# Altium schematic sheet Bluetooth.SchDoc
size A4
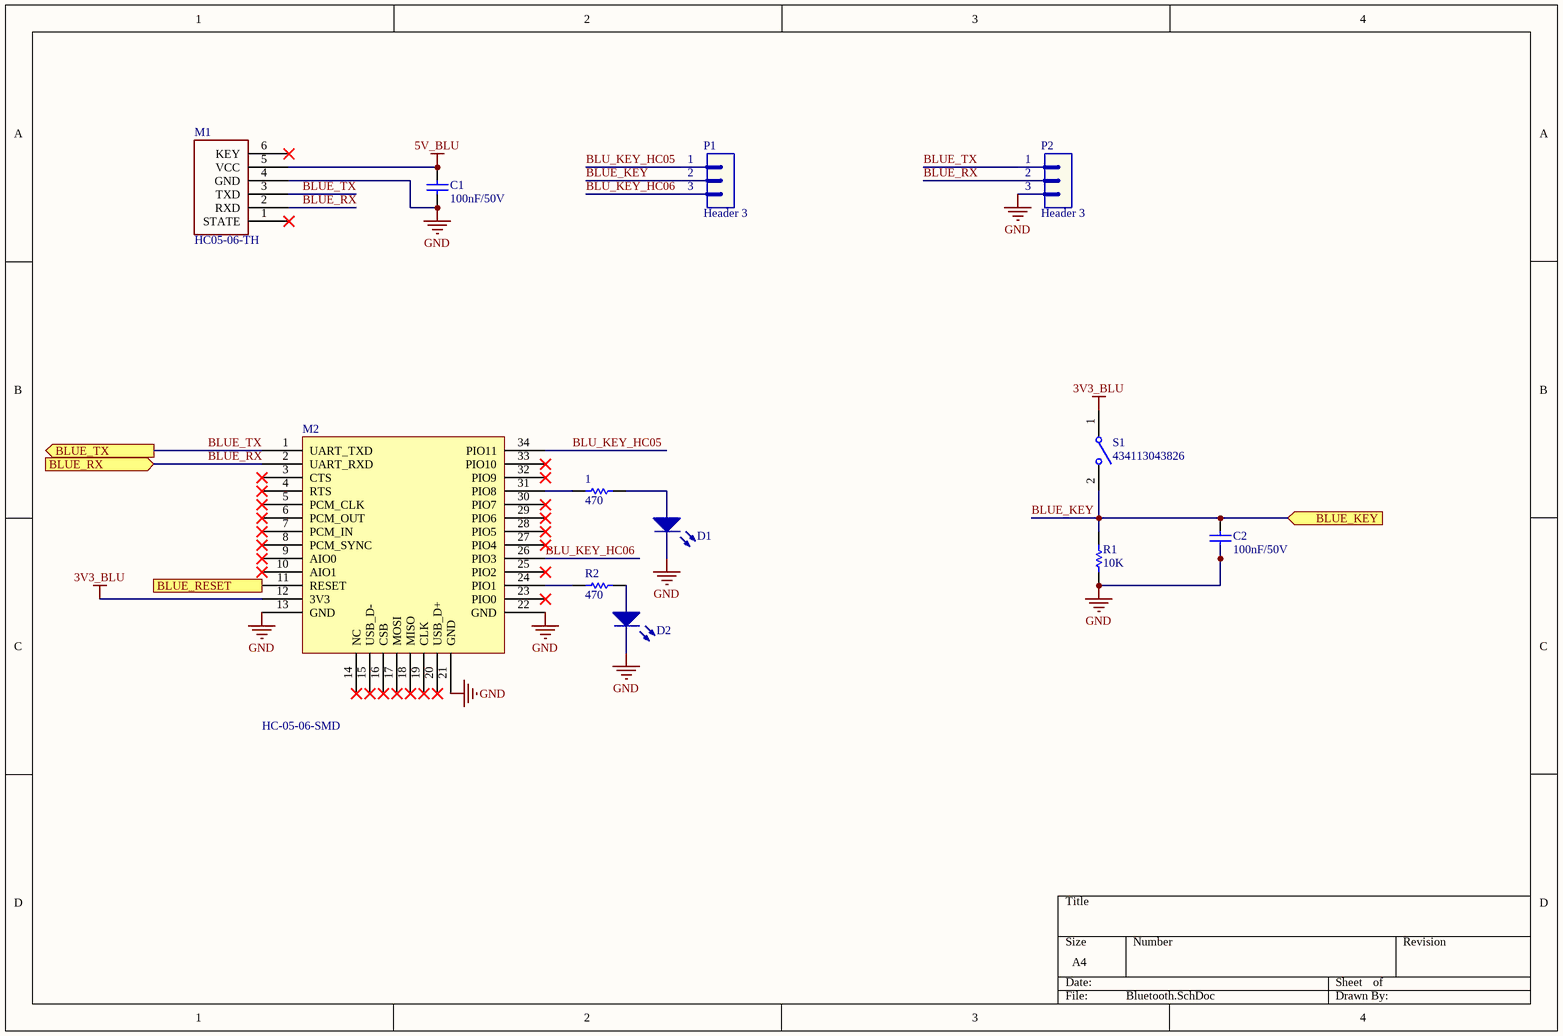
[diagram p0: Bluetooth.SchDoc]

## Parts
1  value 470  [RES-SM-0805]  (hidden comment: Res-1K-0805)
C1  value 100nF/50V  [CAP-SM-0805]  (hidden comment: Cap-1nF-50V-0805)
C2  value 100nF/50V  [CAP-SM-0805]  (hidden comment: Cap-1nF-50V-0805)
D1  LED  [LED_0603_Blue]  (value not drawn)
D2  LED  [LED_0603_Blue]  (value not drawn)
M1  HC05-06-TH  [HC-05-06-TH]
M2  HC-05-06-SMD  [HC-05-06-SMD]
P1  Header 3  [JP3]
P2  Header 3  [JP3]
R1  value 10K  [RES-SM-0805]  (hidden comment: Res-0-0805)
R2  value 470  [RES-SM-0805]  (hidden comment: Res-1K-0805)
S1  434113043826  [434113043826]

## Ports
BLUE_KEY (in), BLUE_RESET (in), BLUE_RX (in), BLUE_TX (out)

## Nets
3V3_BLU: M2.12(3V3) S1.1
5V_BLU: C1.2 M1.5(VCC)
GND: C1.1 C2.1 D1.2(K) D2.2(K) M1.4(GND) M2.13(GND) M2.21(GND) M2.22(GND) P2.3 R1.2
BLU_KEY_HC05: M2.34(PIO11) P1.1
BLU_KEY_HC06: M2.26(PIO3) P1.3
BLUE_KEY: C2.2 P1.2 R1.1 S1.2 ; port BLUE_KEY
BLUE_RESET: M2.11(RESET) ; port BLUE_RESET
BLUE_RX: M1.2(RXD) M2.2(UART_RXD) P2.2 ; port BLUE_RX
BLUE_TX: M1.3(TXD) M2.1(UART_TXD) P2.1 ; port BLUE_TX
Net1_1: 1.1 M2.31(PIO8)
Net1_2: 1.2 D1.1(A)
NetD2_1: D2.1(A) R2.2
NetM2_24: M2.24(PIO1) R2.1

Not connected (* = marked no-connect by the designer): M1 1(STATE)* 6(KEY)*; M2 3(CTS)* 4(RTS)* 5(PCM_CLK)* 6(PCM_OUT)* 7(PCM_IN)* 8(PCM_SYNC)* 9(AIO0)* 10(AIO1)* 14(NC)* 15(USB_D-)* 16(CSB)* 17(MOSI)* 18(MISO)* 19(CLK)* 20(USB_D+)* 23(PIO0)* 25(PIO2)* 27(PIO4)* 28(PIO5)* 29(PIO6)* 30(PIO7)* 32(PIO9)* 33(PIO10)*

## Library data of the parts
1 R2 = Res-1K-0805: RES 1K OHM 1% 1/4W 0805; Manufacturer: Stackpole Electronics Inc; Manufacturer Part Number: RNCP0805FTD1K00; Local Supplier: thegioiic; Local Supplier Link: https://thegioiic.com/products/dien-tro-1k-ohm-0805-5; Supplier 1: Digikey; Supplier 1 Link: https://www.digikey.com/product-detail/en/stackpole-electronics-inc/RNCP0805FTD1K00/RNCP0805FTD1K00CT-ND/2240568; Supplier 1 Part Number: RNCP0805FTD1K00CT-ND
C1 C2 = Cap-1nF-50V-0805: CAP CER 1000PF 100V X7R 0805; Manufacturer: Johanson Dielectrics Inc.; Manufacturer Part Number: 101X15W102MV4E; Local Supplier: thegioiic; Local Supplier Link: https://thegioiic.com/products/tu-1nf-50v-0805; Supplier 1: Digikey; Supplier 1 Link: https://www.digikey.com/product-detail/en/johanson-dielectrics-inc/101X15W102MV4E/709-1335-1-ND/2327235; Supplier 1 Part Number: 709-1335-1-ND
M2 = HC-05-06-SMD: Local supply: Hshop
P1 P2 = Header 3: Header, 3-Pin; LatestRevisionDate: 17-Jul-2002; LatestRevisionNote: Re-released for DXP Platform.; Publisher: Altium Limited
R1 = Res-0-0805: RES 0 OHM JUMPER 0805; Manufacturer: Vishay Dale; Manufacturer Part Number: WSL080500000ZEA9; Local Supplier: thegioiic; Local Supplier Link: https://thegioiic.com/products/dien-tro-0-ohm-0805-5; Supplier 1: Digikey; Supplier 1 Link: https://www.digikey.com/product-detail/en/vishay-dale/WSL080500000ZEA9/541-3928-1-ND/7423223; Supplier 1 Part Number: 541-3928-1-ND
S1 = 434113043826: WS-TASV J-Bend SMT Tact Switch 6x3.5mm, height 4.3mm, 260gf; Rated Voltage: 12VDC; Rated Current: 50mA; Washable: No; ComponentLink1Description: Manufacturer; ComponentLink1URL: http://www.we-online.de; ComponentLink2Description: Datasheet; ComponentLink2URL: https://katalog.we-online.com/em/datasheet/434113043826.pdf; Operating Temperature: -40 to +85degC; Part Number: 434113043826; Published Date: September 2019; Contact Material: Stainless Steel; Height: 4.3mm; Mounting Technology: SMT; Contact Plating: Silver; Operation Force: 260gf; Packaging: Tape and Reel; Terminal Material: Copper Alloy; Publisher: Wurth Elektronik; Terminal Plating: Silver